# EasyEDA Pro project ProProject_OSC1_2025-01-07.epro, board PCB9
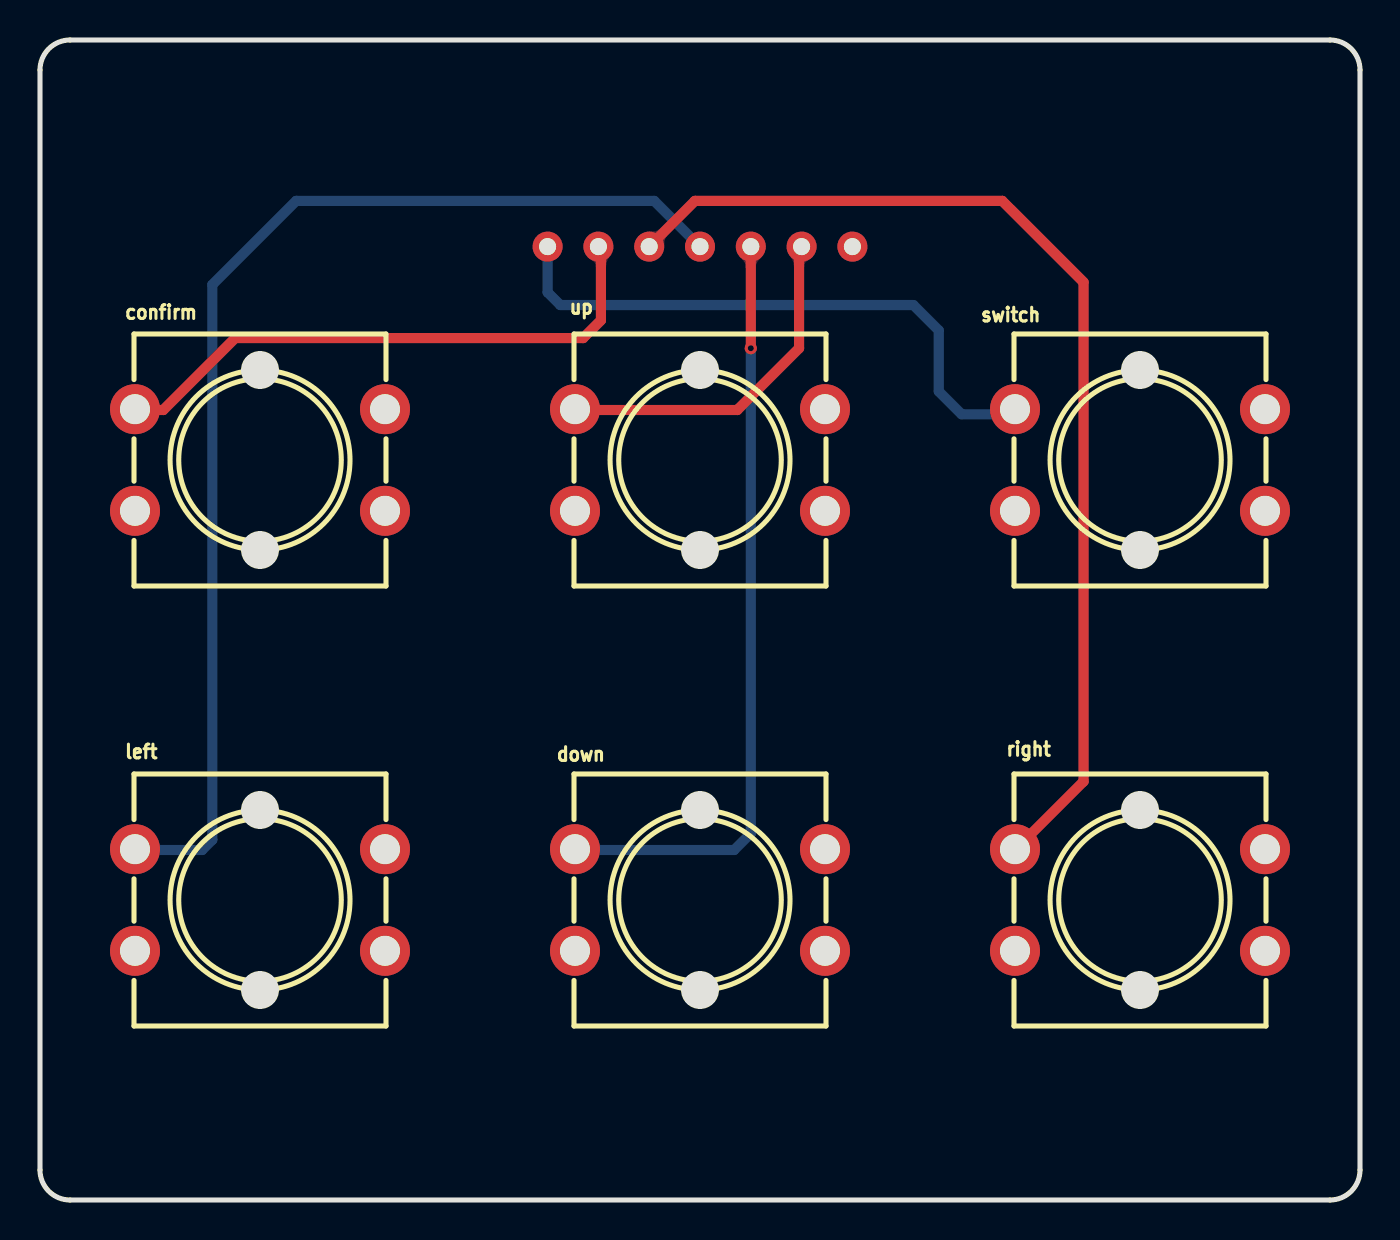
[diagram p14: board, top side]
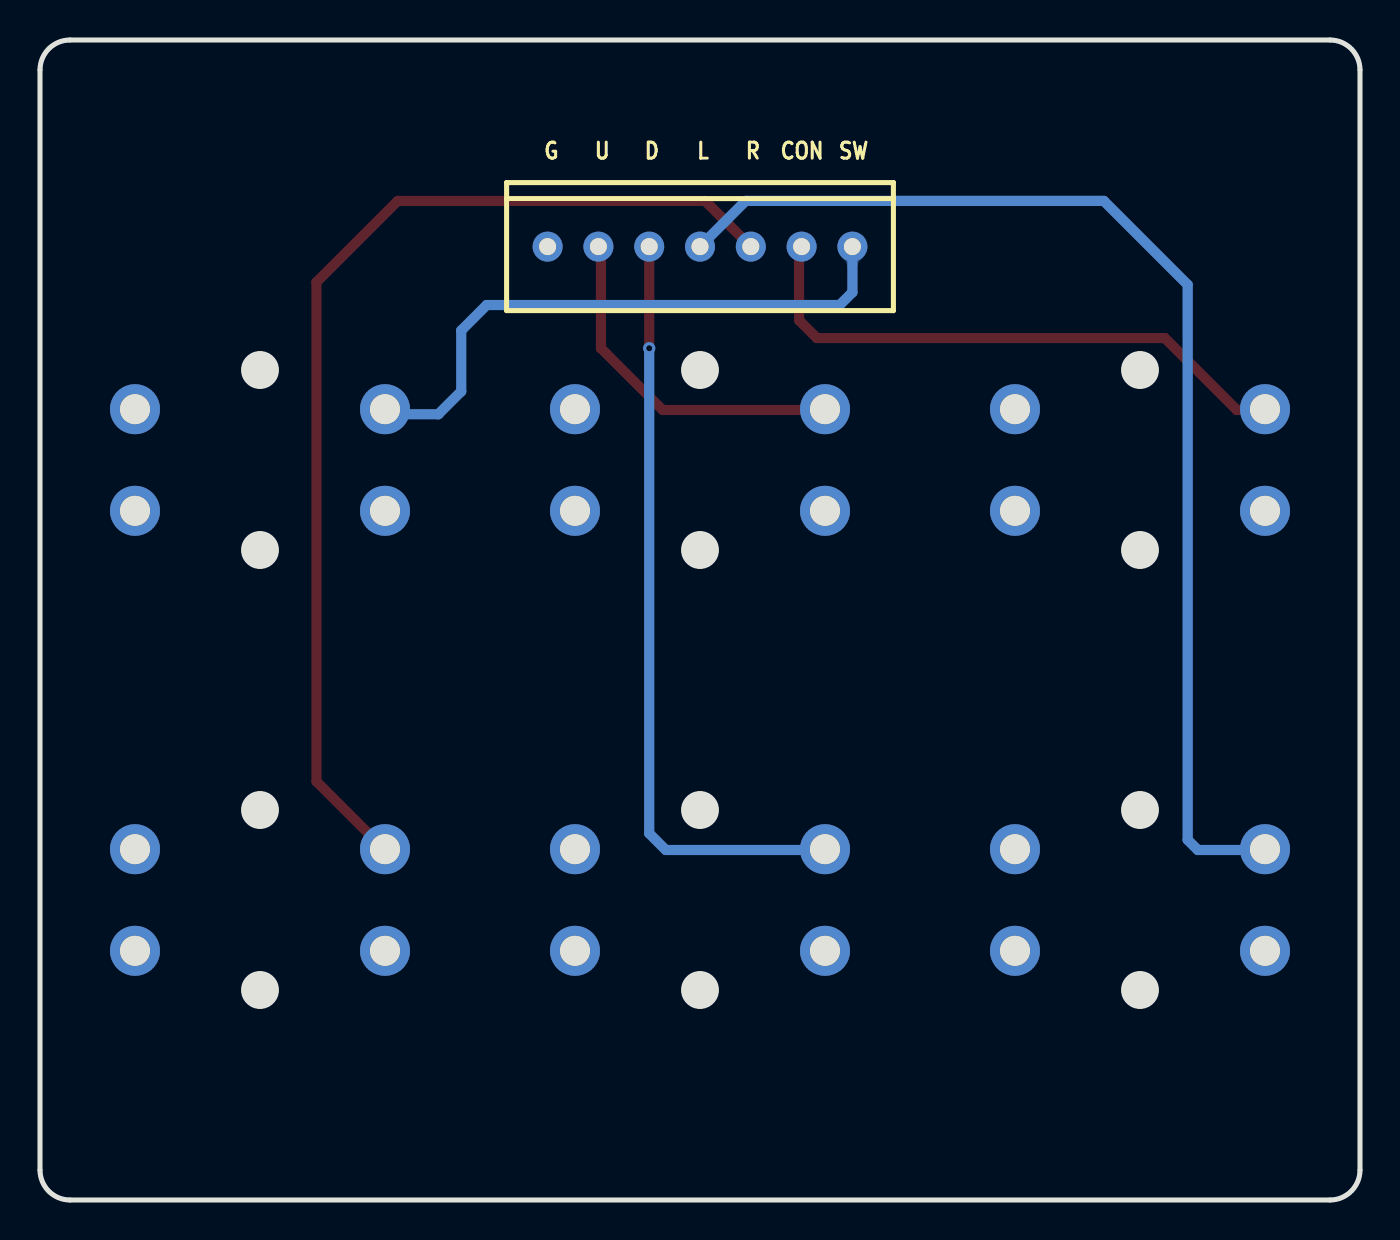
[diagram p15: board, bottom side, seen from below]

Outline 66 x 58 mm; copper layers: Top Layer, Bottom Layer. Coordinates in mm from the lower left corner of the outline.
Outline path: 0,56.5 0,1.5 arc(0.44,0.44) 1.5,0 64.5,0 arc(65.56,0.44) 66,1.5 66,56.5 arc(65.56,57.56) 64.5,58 1.5,58 arc(0.44,57.56) 0,56.5
Stack: Top Layer 0.035mm / Dielectric1 1.51mm FR4 er 4.5 / Bottom Layer 0.035mm

## Design rules (mm)
template: JLCPCB Capability(Two Layers Board)
spacing copperThickness1oz (default): track to track 0.102, other pairs 0.152 to 0.3
spacing copperThickness2oz: track to track 0.203, other pairs 0.152 to 0.3
track width copperThickness1oz (default): min 0.127, default 0.254, max 2.54
track width copperThickness2oz: min 0.203, default 0.254, max 2.54
differential pair differentialPair (default): width min 0.127, default 0.254, max 2.54; gap min 0.152, default 0.152
via viaSize (default): diameter min 0.5, default 0.61, max 10; hole min 0.3, default 0.305, max 6.3

## Placement (name value [footprint] x y rotation side)
confirm  B3F-4055  [B3f]  11 37 180 top
down  B3F-4055  [B3f]  33 15 180 top
left  B3F-4055  [B3f]  11 15 180 top
right  B3F-4055  [B3f]  55 15 180 top
switch  B3F-4055  [B3f]  55 37 180 top
U1  -  [CH2.54-7插座]  33 47.67 180 bottom
up  B3F-4055  [B3f]  33 37 180 top

## Footprints (pads in the part's own frame, mm; a bottom-side part is the same pattern mirrored in y, then rotated)
B3f
  round 2.5 hole 1.5: 1(6.25,-2.54) 2(-6.25,-2.54) 3(6.25,2.54) 4(-6.25,2.54)
CH2.54-7插座
  round 1.5 hole 0.85: 1(-7.62,0) 2(-5.08,0) 3(-2.54,0) 4(0,0) 5(2.54,0) 6(5.08,0) 7(7.62,0)

## Nets
As in the schematic.

Pads without a net: confirm 2 4; down 2 4; left 2 4; right 2 4; switch 2 4; up 2 4

## Via types
v1: diameter 0.61, hole 0.305, Top Layer to Bottom Layer, 1 via

## Routing (per net, layer and track width the routed paths; a pad name or vN(x,y) marks a point on that pad's centre or on a via; arc(x,y) is an arc through that point)
CONFIRM: length 28.9
  Top Layer w0.508: U1.6 28.05,47.54 28.05,43.99 27.16,43.1 9.76,43.1 6.16,39.5 4.75,39.5
DOWN: length 38.5
  Top Layer w0.508: v1(35.54,42.59) U1.3
  Bottom Layer w0.508: 26.75,17.5 34.71,17.5 35.54,18.33 v1(35.54,42.59)
LEFT: length 58.9
  Bottom Layer w0.508: 4.75,17.5 8.11,17.5 8.62,18.01 8.62,45.76 12.81,49.95 30.71,49.95 U1.4
RIGHT: length 54.2
  Top Layer w0.508: 48.75,17.5 52.18,20.93 52.18,45.89 48.11,49.95 32.75,49.95 U1.5
SWITCH: length 30.1
  Bottom Layer w0.508: 48.75,39.5 48.54,39.29 46.08,39.29 44.94,40.43 44.94,43.48 43.67,44.75 26.01,44.75 25.38,45.38 U1.7
UP: length 17.6
  Top Layer w0.508: U1.2 37.95,47.54 37.95,42.59 34.86,39.5 26.75,39.5

## Copper pours and planes (outline as drawn; the poured copper is in the pictures)
GND on Top Layer: -4.72,58.97 70.97,58.97 70.97,-3.51 -4.72,-3.51
GND on Bottom Layer: -1.04,60.37 70.08,60.37 70.08,-4.53 -1.04,-4.53

Small or netless copper shapes (teardrops, artwork), in the pictures only: 4 on Top Layer, 1 on Bottom Layer

## Text on the board
Bottom Silkscreen Layer: SW | CON | R | L | D | U | G
